# Altium schematic sheet Sheet1.SchDoc
size A
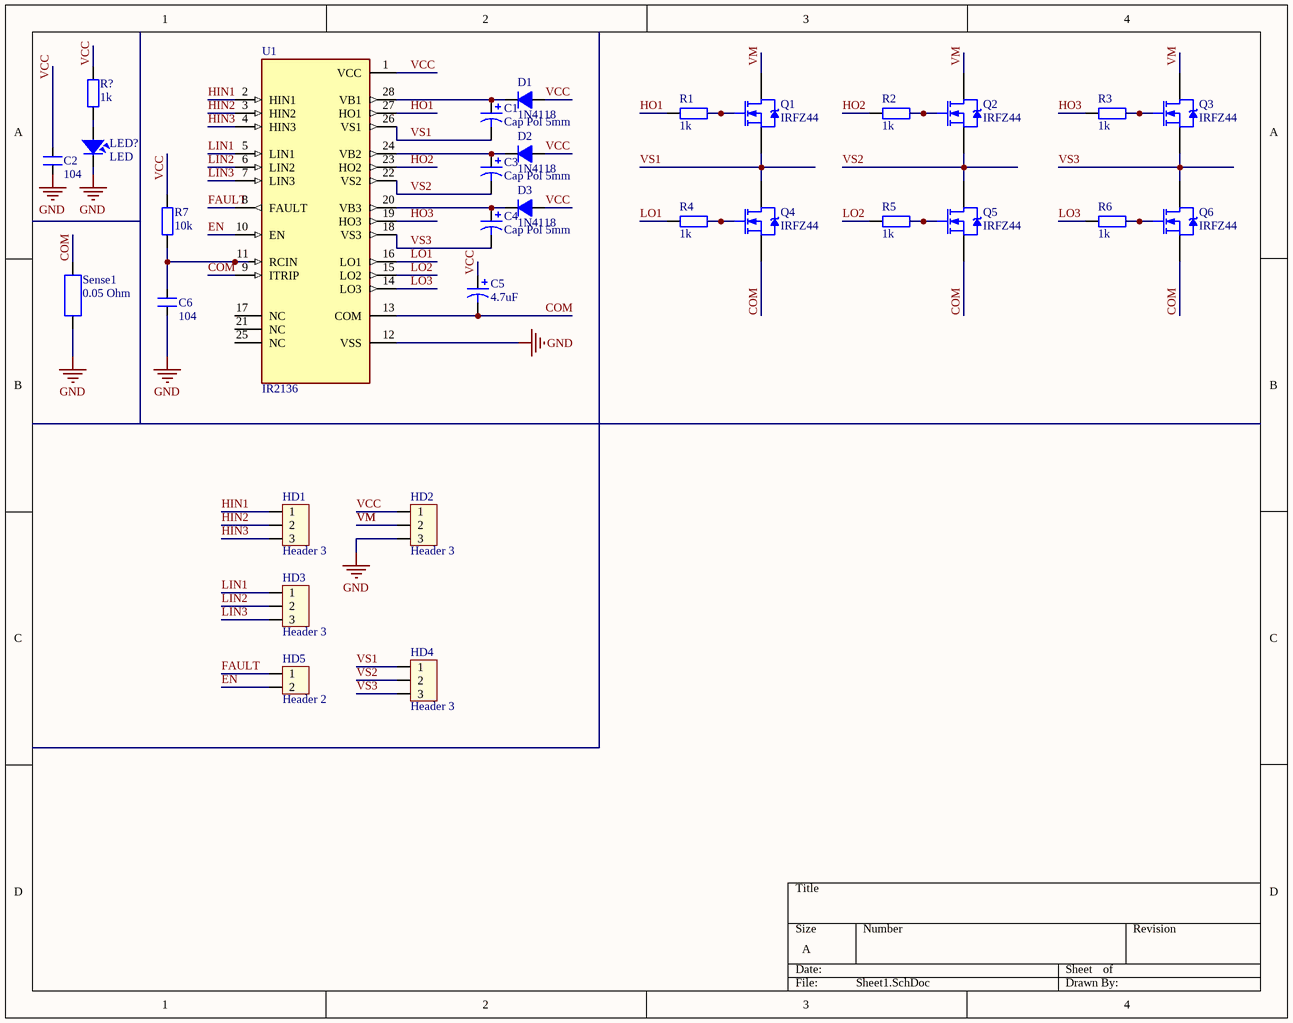
[diagram p0: Sheet1.SchDoc]

## Parts
C1  Cap Pol 5mm  [C5mm]
C2  104  [CN2]
C3  Cap Pol 5mm  [C5mm]
C4  Cap Pol 5mm  [C5mm]
C5  4.7uF  [CAP_POL_5MM]
C6  104  [CN2]
D1  1N4118  [D1A]
D2  1N4118  [D1A]
D3  1N4118  [D1A]
HD1  Header 3  [HED3]
HD2  Header 3  [HED3]
HD3  Header 3  [HED3]
HD4  Header 3  [HED3]
HD5  Header 2  [HED2]
LED?  LED  [LED-3]
Q1  IRFZ44  [QTO-220H3]
Q2  IRFZ44  [QTO-220H3]
Q3  IRFZ44  [QTO-220H3]
Q4  IRFZ44  [QTO-220H3]
Q5  IRFZ44  [QTO-220H3]
Q6  IRFZ44  [QTO-220H3]
R1  1k  [R1/4W]
R2  1k  [R1/4W]
R3  1k  [R1/4W]
R4  1k  [R1/4W]
R5  1k  [R1/4W]
R6  1k  [R1/4W]
R7  10k  [R1/4W]
R?  1k  [R1/4W]
Sense1  0.05 Ohm  [R2W]
U1  IR2136  [DIP1524W45P254L3740H635Q28]

## Nets
GND: C2.1 C6.1 HD2.3 LED?.2 Sense1.1 U1.12(VSS)
COM: C5.2 Q4.3(S) Q5.3(S) Q6.3(S) Sense1.2 U1.9(ITRIP) U1.13(COM)
EN: HD5.2 U1.10(EN)
FAULT: HD5.1 U1.8(FAULT)
HIN1: HD1.1 U1.2(HIN1)
HIN2: HD1.2 U1.3(HIN2)
HIN3: HD1.3 U1.4(HIN3)
HO1: R1.1 U1.27(HO1)
HO2: R2.1 U1.23(HO2)
HO3: R3.1 U1.19(HO3)
LIN1: HD3.1 U1.5(LIN1)
LIN2: HD3.2 U1.6(LIN2)
LIN3: HD3.3 U1.7(LIN3)
LO1: R4.1 U1.16(LO1)
LO2: R5.1 U1.15(LO2)
LO3: R6.1 U1.14(LO3)
VCC: C2.2 C5.1 D1.1(A) D2.1(A) D3.1(A) HD2.1 R7.2 R?.2 U1.1(VCC)
VM: HD2.2 Q1.2(D) Q2.2(D) Q3.2(D)
VS1: C1.2 HD4.1 Q1.3(S) Q4.2(D) U1.26(VS1)
VS2: C3.2 HD4.2 Q2.3(S) Q5.2(D) U1.22(VS2)
VS3: C4.2 HD4.3 Q3.3(S) Q6.2(D) U1.18(VS3)
NetC1_1: C1.1 D1.2(K) U1.28(VB1)
NetC3_1: C3.1 D2.2(K) U1.24(VB2)
NetC4_1: C4.1 D3.2(K) U1.20(VB3)
NetC6_2: C6.2 R7.1 U1.11(RCIN)
NetLED?_1: LED?.1 R?.1
NetQ1_1: Q1.1(G) R1.2
NetQ2_1: Q2.1(G) R2.2
NetQ3_1: Q3.1(G) R3.2
NetQ4_1: Q4.1(G) R4.2
NetQ5_1: Q5.1(G) R5.2
NetQ6_1: Q6.1(G) R6.2

Not connected (* = marked no-connect by the designer): U1 17(NC) 21(NC) 25(NC)

## Library data of the parts
C1 C3 C4 = Cap Pol 5mm: Polarized Capacitor (Axial); Published: 8-Jun-2000; LatestRevisionDate: 17-Jul-2002; LatestRevisionNote: Re-released for DXP Platform.; PackageReference: POLAR0.8; Publisher: Altium Limited
C2 C6 = CN2: Cap np 104 => 105pF; Value: 0.1uF
C5 = Cap Pol 12mm: Polarized Capacitor (Axial); Published: 8-Jun-2000; LatestRevisionDate: 17-Jul-2002; LatestRevisionNote: Re-released for DXP Platform.; PackageReference: POLAR0.8; Publisher: Altium Limited
D1-D3 = D1A: Diode 1A; Value: 1N4007
HD1 HD3 = Header 3: Header 3 (Green); Value: Header 3
HD2 HD4 = Hed3: Header 3 (Green); Value: Header 3
HD5 = Header 2: Header 2 (Green); Value: Header 2
LED? = LED: LED Single colour Green and Red; Value: LED 3 ly Single Colour
Q1-Q6 = IRFZ44: HEXFET N-Channel Power MOSFET
R1-R7 R? = R1/4W: Resistor 1/4W; Value: R1/4W - 1K
Sense1 = R2W: Resistor 2W; Value: R2W - 47
U1 = IR2136: Half-Bridge Gate Driver IC Inverting 44-PLCC, 32 Leads (16.58x16.58); MF: Infineon Technologies; Package: DIP-28 International Rectifier; Price: None; Value: *; SnapEDA_Link: https://www.snapeda.com/parts/IR2136/Infineon+Technologies/view-part/?ref=snap; MP: IR2136; Availability: In Stock; Check_prices: https://www.snapeda.com/parts/IR2136/Infineon+Technologies/view-part/?ref=eda